# Altium schematic sheet InterfaceComUsuario.SchDoc
size A4
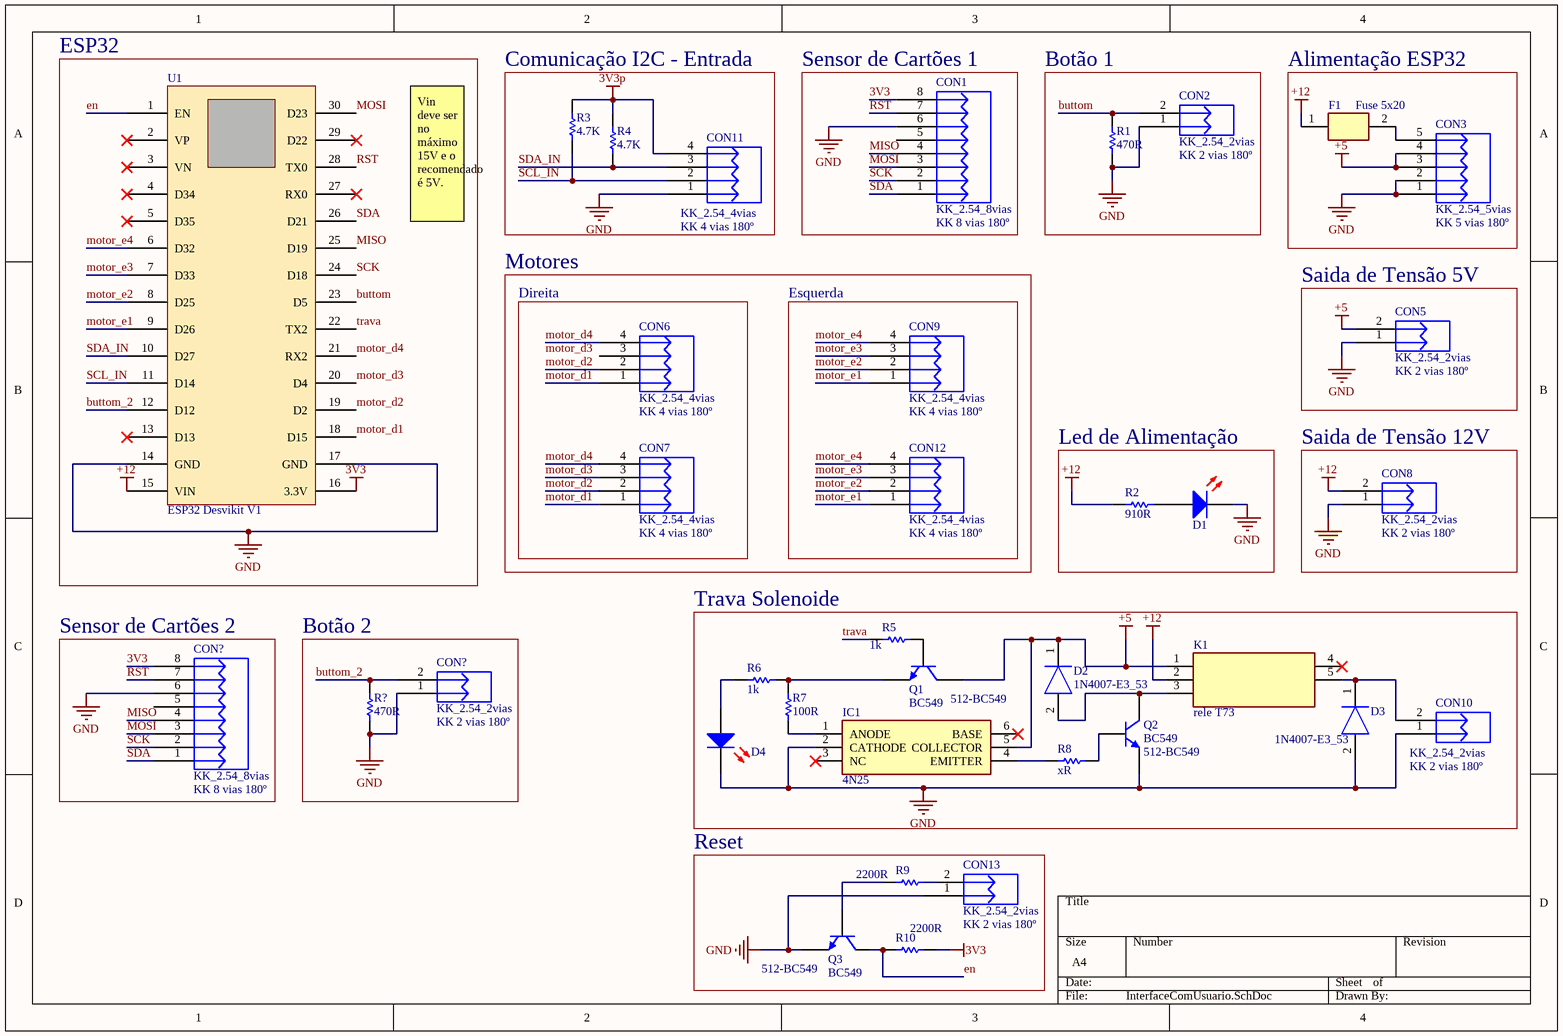
[diagram p0: InterfaceComUsuario.SchDoc]

## Parts
(Parts that share a designator on the sheet are numbered #1, #2 ... from top to bottom, then left to right.)
CON1  KK_2.54_8vias  Valor: KK 8 vias 180º  [KK_8vias_180°]
CON2  KK_2.54_2vias  Valor: KK 2 vias 180º  [KK_2VIAS_180º]
CON3  KK_2.54_5vias  Valor: KK 5 vias 180º  [KK_5vias_180°]
CON5  KK_2.54_2vias  Valor: KK 2 vias 180º  [KK_2VIAS_180º]
CON6  KK_2.54_4vias  Valor: KK 4 vias 180º  [KK_4vias_180°]
CON7  KK_2.54_4vias  Valor: KK 4 vias 180º  [KK_4vias_180°]
CON8  KK_2.54_2vias  Valor: KK 2 vias 180º  [KK_2VIAS_180º]
CON9  KK_2.54_4vias  Valor: KK 4 vias 180º  [KK_4vias_180°]
CON10  KK_2.54_2vias  Valor: KK 2 vias 180º  [KK_2VIAS_180º]
CON11  KK_2.54_4vias  Valor: KK 4 vias 180º  [KK_4vias_180°]
CON12  KK_2.54_4vias  Valor: KK 4 vias 180º  [KK_4vias_180°]
CON13  KK_2.54_2vias  Valor: KK 2 vias 180º  [KK_2VIAS_180º]
CON?#1  KK_2.54_2vias  Valor: KK 2 vias 180º  [KK_2VIAS_180º]
CON?#2  KK_2.54_8vias  Valor: KK 8 vias 180º  [KK_8vias_180°]
D1  LED 5MM RED  [LED 5MM RED]  (value not drawn)
D2  1N4007-E3_53  [DIOAD1405W89L465D235]
D3  1N4007-E3_53  [DIOAD1405W89L465D235]
D4  LED 5MM RED  [LED 5MM RED]  (value not drawn)
F1  Fuse 5x20  [Fuse 5x20]
IC1  4N25  [DIP762W50P254L712H450Q6N]
K1  rele T73  [JQC3FT731Z12VDC]
Q1  BC549  Supplier Part Number 1: 512-BC549  [TO92]
Q2  BC549  Supplier Part Number 1: 512-BC549  [TO92]
Q3  BC549  Supplier Part Number 1: 512-BC549  [TO92]
R1  Resistance (Ohms): 470R  [RES 470R 1/4W CARBON FILM]  (hidden comment: RES 470R 1/4W CARBON FILM)
R2  Resistance (Ohms): 910R  [RES 470R 1/4W CARBON FILM]  (hidden comment: RES 470R 1/4W CARBON FILM)
R3  4.7K  [RES 4.7K 1/4W CARBON FILM]
R4  4.7K  [RES 4.7K 1/4W CARBON FILM]
R5  Resistance (Ohms): 1k  [RES 470R 1/4W CARBON FILM]  (hidden comment: RES 470R 1/4W CARBON FILM)
R6  Resistance (Ohms): 1k  [RES 470R 1/4W CARBON FILM]  (hidden comment: RES 470R 1/4W CARBON FILM)
R7  Resistance (Ohms): 100R  [RES 470R 1/4W CARBON FILM]  (hidden comment: RES 470R 1/4W CARBON FILM)
R8  Resistance (Ohms): xR  [RES 470R 1/4W CARBON FILM]  (hidden comment: RES 470R 1/4W CARBON FILM)
R9  Resistance (Ohms): 2200R  [RES 470R 1/4W CARBON FILM]  (hidden comment: RES 470R 1/4W CARBON FILM)
R10  Resistance (Ohms): 2200R  [RES 470R 1/4W CARBON FILM]  (hidden comment: RES 470R 1/4W CARBON FILM)
R?  Resistance (Ohms): 470R  [RES 470R 1/4W CARBON FILM]  (hidden comment: RES 470R 1/4W CARBON FILM)
U1  value ESP32 Desvikit V1  [ESP32_Desvikit_v1]  (hidden comment: microcontrolador)

## Blocks framed on the sheet
ESP32: U1
Comunicação I2C - Entrada: CON11 R3 R4
Sensor de Cartões 1: CON1
Botão 1: CON2 R1
Alimentação ESP32: CON3 F1
Direita: CON6 CON7
Esquerda: CON9 CON12
Saida de Tensão 5V: CON5
Led de Alimentação: D1 R2
Saida de Tensão 12V: CON8
Trava Solenoide: CON10 D2-D4 IC1 K1 Q1 Q2 R5-R8
Sensor de Cartões 2: CON?#2
Botão 2: CON?#1 R?
Reset: CON13 Q3 R9 R10

## Nets
3V3: CON1.8 CON?#2.8 R10.2 U1.16(3.3V)
3V3p: CON11.4 R3.1 R4.1
+5: CON3.3 CON3.4 CON5.2 D2.1(K) IC1.5(COLLECTOR) K1.1(COIL_1) Q1.1(C)
+12: CON8.2 F1.1(COIL_1) K1.2(NC) R2.2 U1.15(VIN)
GND: CON1.6 CON2.1 CON3.1 CON3.2 CON5.1 CON8.1 CON10.1 CON11.1 CON13.1 CON?#1.1 CON?#2.6 D1.2(K) D3.2(A) D4.2(K) IC1.2(CATHODE) Q2.3(E) Q3.3(E) R1.1 R?.1 U1.14(GND) U1.17(GND)
buttom: CON2.2 R1.2 U1.23(D5)
buttom_2: CON?#1.2 R?.2 U1.12(D12)
en: Q3.1(C) R10.1 U1.1(EN)
MISO: CON1.4 CON?#2.4 U1.25(D19)
MOSI: CON1.3 CON?#2.3 U1.30(D23)
motor_d1: CON6.1 CON7.1 U1.18(D15)
motor_d2: CON6.2 CON7.2 U1.19(D2)
motor_d3: CON7.3 U1.20(D4)
motor_d4: CON6.4 CON7.4 U1.21(RX2)
motor_e1: CON9.1 CON12.1 U1.9(D26)
motor_e2: CON9.2 CON12.2 U1.8(D25)
motor_e3: CON9.3 CON12.3 U1.7(D33)
motor_e4: CON9.4 CON12.4 U1.6(D32)
RST: CON1.7 CON?#2.7 U1.28(TX0)
SCK: CON1.2 CON?#2.2 U1.24(D18)
SCL_IN: CON11.2 R3.2 U1.11(D14)
SDA: CON1.1 CON?#2.1 U1.26(D21)
SDA_IN: CON11.3 R4.2 U1.10(D27)
trava: R5.1 U1.22(TX2)
NetCON3_5: CON3.5 F1.2(COIL_2)
NetCON10_2: CON10.2 D3.1(K) K1.5(COM)
NetCON13_2: CON13.2 R9.2
NetD1_1: D1.1(A) R2.1
NetD2_2: D2.2(A) K1.3(NO) Q2.1(C)
NetD4_1: D4.1(A) R6.2
NetIC1_1: IC1.1(ANODE) R7.1
NetIC1_4: IC1.4(EMITTER) R8.2
NetQ1_2: Q1.2(B) R5.2
NetQ1_3: Q1.3(E) R6.1 R7.2
NetQ2_2: Q2.2(B) R8.1
NetQ3_2: Q3.2(B) R9.1

Not connected (* = marked no-connect by the designer): CON1 5; CON6 3; CON?#2 5; IC1 3(NC)* 6(BASE)*; K1 4(COIL_2)*; U1 2(VP)* 3(VN)* 4(D34)* 5(D35)* 13(D13)* 27(RX0)* 29(D22)*

## Notes on the sheet
- Vin deve ser no máximo 15V e o recomendado é 5V.
- Motores
- Labels drawn without touching a wire or pin: motor_d3

## Library data of the parts
CON1 CON?#2 = KK_2.54_8vias: Conector KK 2.54mm 8 vias; Descrição: Conector KK 3 vias com passo 2.54mm; Encapsulamento: PTH - 180º; Modelo: 3 vias - 180º; Marca: *; Observação: *
CON2 CON5 CON8 CON10 CON13 CON?#1 = KK_2.54_2vias: Conector KK 2.54mm 2 vias; Descrição: Conector KK 3 vias com passo 2.54mm; Encapsulamento: PTH - 180º; Modelo: 2 vias - 180º; Marca: *; Observação: *
CON3 = KK_2.54_5vias: Conector KK 2.54mm 5 vias; Descrição: Conector KK 3 vias com passo 2.54mm; Encapsulamento: PTH - 180º; Modelo: 3 vias - 180º; Marca: *; Observação: *
CON6 CON7 CON9 CON11 CON12 = KK_2.54_4vias: Conector KK 2.54mm 4 vias; Descrição: Conector KK 3 vias com passo 2.54mm; Encapsulamento: PTH - 180º; Modelo: 3 vias - 180º; Marca: *; Observação: *
D1 D4 = LED 5MM RED: Manufacturer: Paralight; Manufacturer Part Number: IMP585; Bulb Size: 3mm; Wavelength Typ: 625; Forward Voltage: 2; Forward Current If: 20; Luminous Intensity: 3; LED Mounting: Through Hole; Lens Shape: Round; Viewing Angle: 60°; SVHC: No SVHC (15-Jun-2015); External Diameter: 2.9; External Length / Height: 4.6; Forward Voltage VF Max: 2.5; LED / Lamp Size: 3mm / T-1; LED Type: Standard; Lead Cross-section Depth: 0.5; Luminous Intensity @ If Min: 0.7; PIV Max: 5; Peak Forward Current: 7; Voltage Vf Typ: 2.2V<!--FANDB--><div class="features-and-benefits-container"><div class="features-and-benefits-description"><span class="features-benefits-value">The L-934LID from Kingbright is a through hole round shape high efficiency red colour LED. The device is made of gallium arsenide phosphide on gallium phosphide orange light emitting diode. This LED is widely used because of low power consumption, long life and solid state reliability.</span></div><div class="features-and-benefits-list"><ul class="features-and-benefits-list-list"><li class="features-and-benefits-list-item">Standard bulb size of T-1 (3mm)</li><li class="features-and-benefits-list-item">Reliable and rugged</li><li class="features-and-benefits-list-item">Viewing angle is 60°</li><li class="features-and-benefits-list-item">Luminous intensity of 3mcd at 2mA</li><li class="features-and-benefits-list-item">Forward voltage is 2.0V</li><li class="features-and-benefits-list-item">Forward current (If) is 20mA</li><li class="features-and-benefits-list-item">Dominant wavelength is 625nm at IF=20mA</li><li class="features-and-benefits-list-item">Peak wavelength is 627nm at IF=20; Supplier 1: Mult Comercial; RoHS: YES; Stock 1: 35260; Pricing 1: 1=0.15 (BRL); LED Colour: Red; Packaging: Each; MSL: -; Current If Luminous Intensity: 2; Dominant Wavelength: 625; Forward Current If Max: 20; Lead Cross-section Width: 0.5; Lead Spacing: 2.54; Luminous Intensity Typ: 3; Mounting Type: PCB Through Hole; No. of Pins: 2; Operating Temperature Max: 85; Operating Temperature Min: -40; Operating Temperature Range: -40°C to +85; Peak Wavelength: 625; ComponentLink1URL: http://loja.multcomercial.com.br/led-3mm-vermelho-difuso-l-314hd-paralight.html; ComponentLink1Description: http://loja.multcomercial.com.br/led-3mm-vermelho-difuso-l-314hd-paralight.html; Supplier Part Number 1: Led 3mm Vermelho Difuso L-314HD - Paralight
D2 D3 = 1N4007-E3_53: Diode; Manufacturer_Name: Vishay; Manufacturer_Part_Number: 1N4007-E3/53; Datasheet Link: http://www.vishay.com/docs/88503/1n4001.pdf; Mouser Part Number: 625-1N4007-E3/53; Mouser Price/Stock: https://www.mouser.co.uk/ProductDetail/Vishay-General-Semiconductor/1N4007-E3-53/?qs=N4vtoAxH%2FSpFgYSIWmQOdg%3D%3D; Arrow Part Number: 1N4007-E3/53; Arrow Price/Stock: https://www.arrow.com/en/products/1n4007-e353/vishay
F1 = Fuse 5x20: Fuse; Manufacturer_Name: QIANJI; Manufacturer_Part_Number: JQC-3F-(T73)-1Z-12VDC; Datasheet Link: https://img.ozdisan.com/ETicaret_Dosya/341245_8627675.pdf; Height: 15.5mm
IC1 = 4N25: Integrated Circuit; Manufacturer_Name: Isocom; Datasheet Link: http://www.farnell.com/datasheets/90919.pdf; Height: 4.5mm; Manufacturer_Part_Number: 4N25; Arrow Part Number: 4N25; Arrow Price/Stock: https://www.arrow.com/en/products/4n25/isocom
K1 = rele T73: Relay or Contactor; Manufacturer_Name: QIANJI; Manufacturer_Part_Number: JQC-3F-(T73)-1Z-12VDC; Datasheet Link: https://img.ozdisan.com/ETicaret_Dosya/341245_8627675.pdf; Height: 15.5mm
Q1-Q3 = BC549: TRANS NPN 30V 0.1A TO-92; Manufacturer: Fairchild Semiconductor; Configuration: Single; Emitter- Base Voltage VEBO: 5 V; Collector-Emitter Saturation Voltage: 200 mV; Gain Bandwidth Product fT: 300 MHz; DC Collector/Base Gain hfe Min: 110; DC Current Gain hFE Max: 800; Maximum Power Dissipation: 0.5 W; Supplier 1: Mouser; Manufacturer Part Number: BC549; Product Category: Bipolar Transistors - BJT; RoHS: Details; Transistor Polarity: NPN; Collector- Base Voltage VCBO: 30 V; Collector- Emitter Voltage VCEO Max: 30 V; Maximum DC Collector Current: 0.1 A; Maximum Operating Temperature: + 150 C; Mounting Style: Through Hole; Package / Case: TO-92-3; Brand: Fairchild Semiconductor; Minimum Operating Temperature: - 65 C; Packaging: Bulk; Series: BC549; Factory Pack Quantity: 2000; ComponentLink1URL: https://datasheet.ciiva.com/982/bc546-982130.pdf; ComponentLink1Description: https://datasheet.ciiva.com/982/bc546-982130.pdf; ComponentLink2URL: https://datasheet.ciiva.com/17179/bc549-17179663.pdf; ComponentLink2Description: https://datasheet.ciiva.com/17179/bc549-17179663.pdf
R1 R2 R5-R10 R? = RES 470R 1/4W CARBON FILM: RES 470R OHM 1/4W 5% CARBON FILM; Manufacturer: Ty-Ohm; Manufacturer Part Number: CR25; Power (Watts): 0.25W, 1/4W; Temperature Coefficient: 0/ -500ppm/°C; Supplier 1: Mult Comercial; RoHS: RoHS Compliant; Category: Resistors; Stock 1: 617543; Pricing 1: 1=0.20 (BRL); Packaging: Cut Tape (CT); Tolerance: ±5%; Composition: Carbon Film; Features: Flame Retardant Coating, Safety; Operating Temperature: -55°C ~ 155°C; Package / Case: Axial; Supplier Device Package: Axial; Size / Dimension: 0.091" Dia x 0.256" L (2.30mm x 6.50mm); Height: -; Number of Terminations: 2; ComponentLink1URL: http://loja.multcomercial.com.br/resistor-de-1-4-de-watt-cr25-5-de-tolerancia.html; ComponentLink1Description: http://loja.multcomercial.com.br/resistor-de-1-4-de-watt-cr25-5-de-tolerancia.html; Supplier Part Number 1: Resistor de Filme de Carbono 1/4 de Watt CR25 5% de tolerância - 0.22R Ω à 10M Ω
R3 R4 = RES 4.7K 1/4W CARBON FILM: RES 4.7K OHM 1/4W 5% CARBON FILM; Manufacturer: Ty-Ohm; Manufacturer Part Number: CR25; Power (Watts): 0.25W, 1/4W; Temperature Coefficient: 0/ -500ppm/°C; Supplier 1: Mult Comercial; RoHS: RoHS Compliant; Category: Resistors; Stock 1: 617543; Pricing 1: 1=0.20 (BRL); Packaging: Cut Tape (CT); Tolerance: ±5%; Composition: Carbon Film; Features: Flame Retardant Coating, Safety; Operating Temperature: -55°C ~ 155°C; Package / Case: Axial; Supplier Device Package: Axial; Size / Dimension: 0.091" Dia x 0.256" L (2.30mm x 6.50mm); Height: -; Number of Terminations: 2; ComponentLink1URL: http://loja.multcomercial.com.br/resistor-de-1-4-de-watt-cr25-5-de-tolerancia.html; ComponentLink1Description: http://loja.multcomercial.com.br/resistor-de-1-4-de-watt-cr25-5-de-tolerancia.html; Supplier Part Number 1: Resistor de Filme de Carbono 1/4 de Watt CR25 5% de tolerância - 0.22R Ω à 10M Ω; Resistance (Ohms): ?
U1 = ESP32 Desvikit v1: microcontrolador com moculo bluethoth e wifi